# EAGLE schematic Nano CAN shield v0.1 (EAGLE 9.3.1)

## Sheet 1 of 2
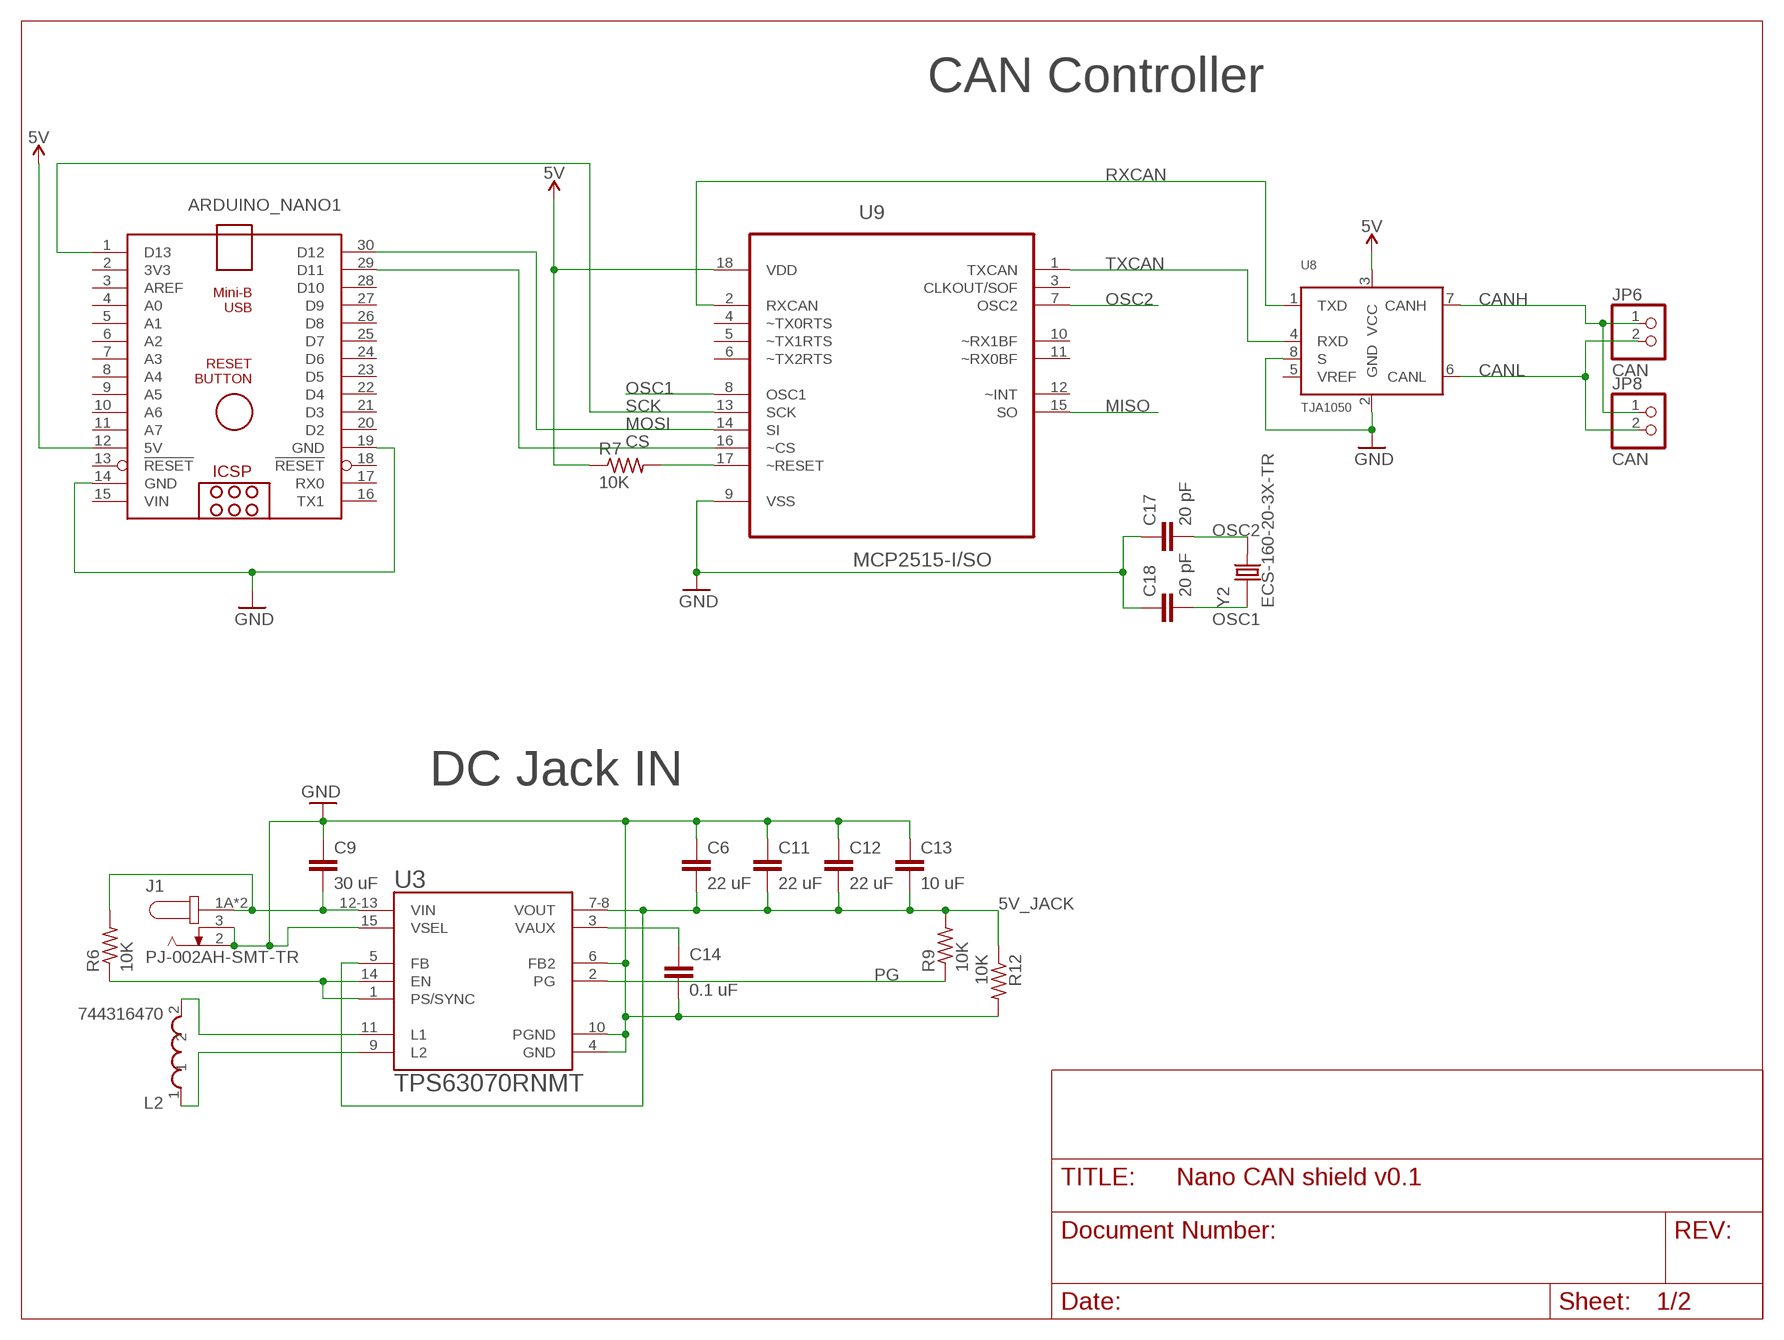
[diagram p0: schematic, sheet 1]

### Parts
ARDUINO_NANO1  ARDUINO_NANO  [ARDUINO_NANO]
C6  22 uF  C-EUC0603  [C0603]
C9  30 uF  C-EUC0603  [C0603]
C11  22 uF  C-EUC0603  [C0603]
C12  22 uF  C-EUC0603  [C0603]
C13  10 uF  C-EUC0603  [C0603]
C14  0.1 uF  C-EUC0603  [C0603]
C17  20 pF  C-EUC0603  [C0603]
C18  20 pF  C-EUC0603  [C0603]
J1  PJ-002AH-SMT-TR  [CUI_PJ-002AH-SMT-TR]
JP6  CAN  PINHD-1X2  [1X02]
JP8  CAN  PINHD-1X2  [1X02]
L2  744316470  [INDC2220X16]
R6  10K  R-US_R0603  [R0603]
R7  10K  R-US_R0603  [R0603]
R9  10K  R-US_R0603  [R0603]
R12  10K  R-US_R0603  [R0603]
U3  TPS63070RNMT  [QFN50P250X300X100-15N]
U8  TJA1050  [SOT96-1]
U9  MCP2515-I/SO  [SOIC127P1034X264-18N]
Y2  ECS-160-20-3X-TR  [XTAL_ECS-160-20-3X-TR]

### Nets
5V: ARDUINO_NANO1.12(5V) R7.1 U8.3(VCC) U9.18(VDD)
5V_JACK: C6.2 C11.2 C12.2 C13.2 R9.2 R12.1 U3.5(FB) U3.7-8(VOUT)
CANH: JP6.1 JP8.1 U8.7(CANH)
CANL: JP6.2 JP8.2 U8.6(CANL)
CS: ARDUINO_NANO1.29(D11) U9.16(~CS)
GND: ARDUINO_NANO1.14(GND) ARDUINO_NANO1.19(GND) C6.1 C9.1 C11.1 C12.1 C13.1 C14.2 C17.1 C18.1 J1.2 J1.3 R12.2 U3.4(GND) U3.6(FB2) U3.10(PGND) U3.15(VSEL) U8.2(GND) U8.8(S) U9.9(VSS)
MISO: U9.15(SO)
MOSI: ARDUINO_NANO1.30(D12) U9.14(SI)
N$7: C9.2 J1.1A J1.1B R6.2 U3.12-13(VIN)
N$13: L2.2 U3.11(L1)
N$14: L2.1 U3.9(L2)
N$15: C14.1 U3.3(VAUX)
N$20: R6.1 U3.1(PS/SYNC) U3.14(EN)
N$27: R7.2 U9.17(~RESET)
OSC1: C18.2 U9.8(OSC1) Y2.1
OSC2: C17.2 U9.7(OSC2) Y2.2
PG: R9.1 U3.2(PG)
RXCAN: U8.1(TXD) U9.2(RXCAN)
SCK: ARDUINO_NANO1.1(D13) U9.13(SCK)
TXCAN: U8.4(RXD) U9.1(TXCAN)
Unconnected: ARDUINO_NANO1.2(3V3) ARDUINO_NANO1.3(AREF) ARDUINO_NANO1.4(A0) ARDUINO_NANO1.5(A1) ARDUINO_NANO1.6(A2) ARDUINO_NANO1.7(A3) ARDUINO_NANO1.8(A4) ARDUINO_NANO1.9(A5) ARDUINO_NANO1.10(A6) ARDUINO_NANO1.11(A7) ARDUINO_NANO1.13(!RESET) ARDUINO_NANO1.16(TX1) ARDUINO_NANO1.17(RX0) ARDUINO_NANO1.18(!RESET) ARDUINO_NANO1.20(D2) ARDUINO_NANO1.21(D3) ARDUINO_NANO1.22(D4) ARDUINO_NANO1.23(D5) ARDUINO_NANO1.24(D6) ARDUINO_NANO1.25(D7) ARDUINO_NANO1.26(D8) ARDUINO_NANO1.27(D9) ARDUINO_NANO1.28(D10) U8.5(VREF) U9.3(CLKOUT/SOF) U9.4(~TX0RTS) U9.5(~TX1RTS) U9.6(~TX2RTS) U9.10(~RX1BF) U9.11(~RX0BF) U9.12(~INT)

### Notes on the sheet
- CAN Controller
- DC Jack IN

## Sheet 2 of 2
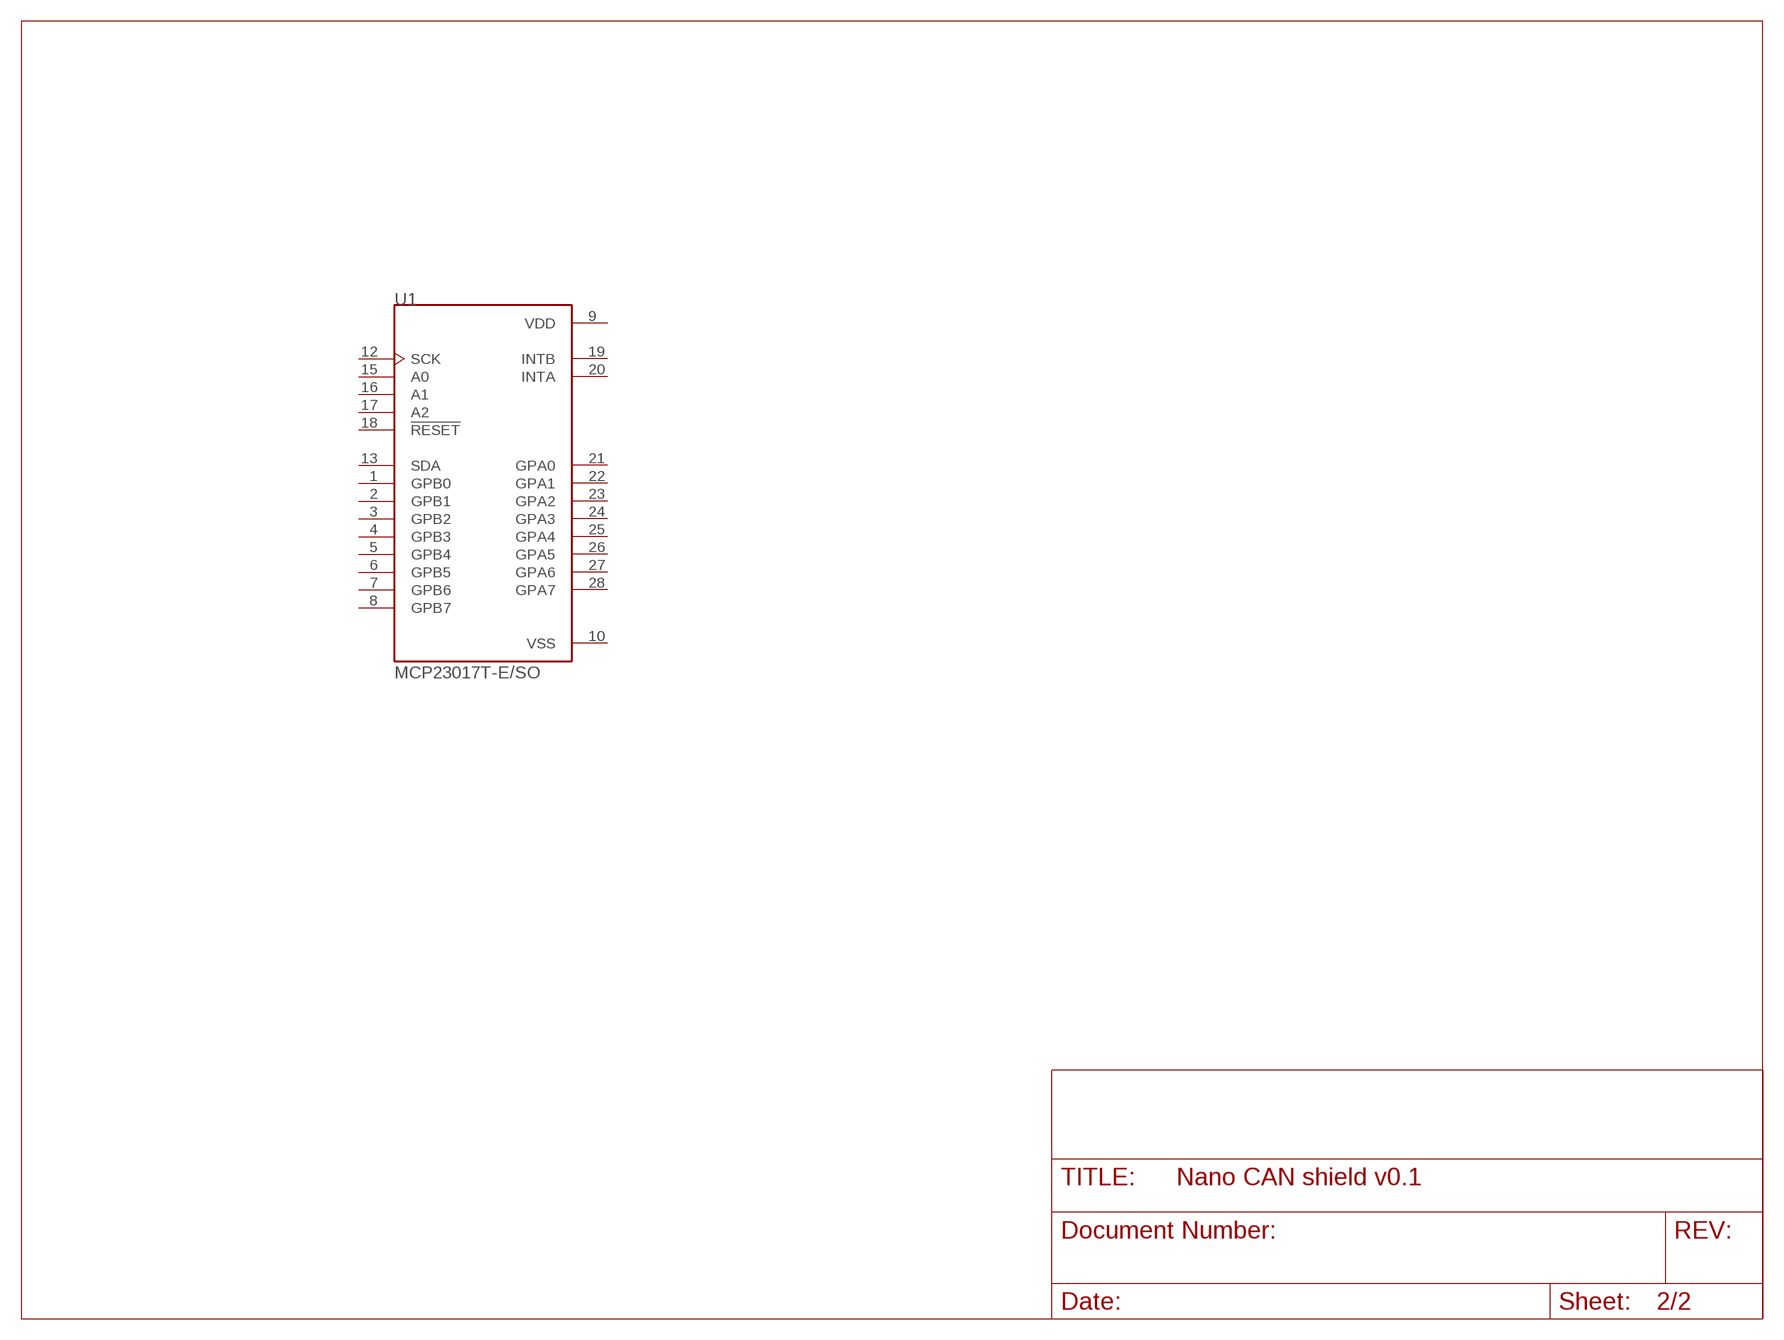
[diagram p1: schematic, sheet 2]

### Parts
U1  MCP23017T-E/SO  [SOIC127P1030X265-28N]
Unconnected: U1.1(GPB0) U1.2(GPB1) U1.3(GPB2) U1.4(GPB3) U1.5(GPB4) U1.6(GPB5) U1.7(GPB6) U1.8(GPB7) U1.12(SCK) U1.13(SDA) U1.15(A0) U1.16(A1) U1.17(A2) U1.18(!RESET) U1.19(INTB) U1.20(INTA) U1.21(GPA0) U1.22(GPA1) U1.23(GPA2) U1.24(GPA3) U1.25(GPA4) U1.26(GPA5) U1.27(GPA6) U1.28(GPA7)

## Power pins joined to a net without a drawn wire
VDD: U1.9(VDD)
VIN: ARDUINO_NANO1.15(VIN)
VSS: U1.10(VSS)

## Library data of the parts
ARDUINO_NANO1 = ArduinoNanoV30:ARDUINO_NANO: Arduino Nano V3.0 Overview: The Arduino Nano is a small, complete, and breadboard-friendly board based on the ATmega328 (Arduino Nano 3.x) or ATmega168 (Arduino Nano 2.x). It has more or less the same functionality of the Arduino Duemilanove, but in a different package. It lacks only a DC power jack, and works with a Mini-B USB cable instead of a standard one. The Nano was designed and is being produced by Gravitech. Specifications: Microcontroller Atmel ATmega168 or ATmega328 Operating Voltage (logic level) 5 V Input Voltage (recommended) 7-12 V Input Voltage (limits) 6-20 V Digital I/O Pins 14 (of which 6 provide PWM output) Analog Input Pins 8 DC Current per I/O Pin 40 mA Flash Memory 16 KB (ATmega168) or 32 KB (ATmega328) of which 2 KB used by bootloader SRAM 1 KB (ATmega168) or 2 KB (ATmega328) EEPROM 512 bytes (ATmega168) or 1 KB (ATmega328) Clock Speed 16 MHz Dimensions 0.73" x 1.70" Length 45 mm Width 18 mm Weigth 5 g Power: The Arduino Nano can be powered via the Mini-B USB connection, 6-20V unregulated external power supply (pin 30), or 5V regulated external power supply (pin 27). The power source is automatically selected to the highest voltage source. Memory: The ATmega168 has 16 KB of flash memory for storing code (of which 2 KB is used for the bootloader); the ATmega328 has 32 KB, (also with 2 KB used for the bootloader). The ATmega168 has 1 KB of SRAM and 512 bytes of EEPROM (which can be read and written with the EEPROM library); the ATmega328 has 2 KB of SRAM and 1 KB of EEPROM. Input and Output: Each of the 14 digital pins on the Nano can be used as an input or output, using pinMode(), digitalWrite(), and digitalRead() functions. They operate at 5 volts. Each pin can provide or receive a maximum of 40 mA and has an internal pull-up resistor (disconnected by default) of 20-50 kOhms. In addition, some pins have specialized functions. Visit Arduino - ArduinoBoardNano <https://www.arduino.cc/en/Main/ArduinoBoardNano>
C6 C9 C11-C14 C17 C18 = rcl:C-EU: CAPACITOR, European symbol; SPICEPREFIX: C
J1 = PJ-002AH-SMT-TR:PJ-002AH-SMT-TR: 2.0 mm Center Pin, 5.0 A, Right Angle, Surface Mount (SMT), Dc Power Jack Connector; CUI_PURCHASE_URL: https://www.cui.com/product/interconnect/dc-power-connectors/jacks/2.0-mm-center-pin/pj-002ah-smt-tr?utm_source=snapeda.com&utm_medium=referral&utm_campaign=snapedaBOM; DESCRIPTION: 24 VDC 5 A Surface Mount Unshielded 2 Conductors 3 Contacts Male Power Jack; DIGI-KEY_PART_NUMBER: CP-002AHPJCT-ND; DIGI-KEY_PURCHASE_URL: https://www.digikey.com/product-detail/en/cui-inc/PJ-002AH-SMT-TR/CP-002AHPJCT-ND/669692?utm_source=snapeda&utm_medium=aggregator&utm_campaign=symbol; MF: CUI Inc.; MP: PJ-002AH-SMT-TR; PACKAGE: None
JP6 JP8 = pinhead:PINHD-1X2: PIN HEADER
L2 = 744316470:744316470: Surface Mount Power Inductor, WE-HCI Series, 4.7 H, 20%, Shielded, 0.0245 ohm, 4.6 A; AVAILABILITY: Unavailable; DESCRIPTION: Surface Mount Power Inductor, WE-HCI Series, 4.7 H, 20%, Shielded, 0.0245 ohm, 4.6 A; MF: Wurth Electronics; MP: 744316470; PACKAGE: SMD-2 Würth Elektronik; PRICE: None
R6 R7 R9 R12 = rcl:R-US_: RESISTOR, American symbol; SPICEPREFIX: R
U1 = MCP23017T-E_SO:MCP23017T-E/SO: 16-bit Input/Output Expander, I2C interface, Pb-free28 SOIC .300in T/R; DESCRIPTION: 16-bit Input/Output Expander, I2C interface, Pb-free28 SOIC .300in T/R; DIGI-KEY_PART_NUMBER: MCP23017T-E/SOCT-ND; DIGI-KEY_PURCHASE_URL: https://www.digikey.com/product-detail/en/microchip-technology/MCP23017T-E-SO/MCP23017T-E-SOCT-ND/5358289?utm_source=snapeda&utm_medium=aggregator&utm_campaign=symbol; MF: Microchip; MP: MCP23017T-E/SO; PACKAGE: SOIC-28 Microchip
U3 = TPS63070RNMT:TPS63070RNMT: Wide Input Voltage (2V-16V) Buck-Boost Converter 15-VQFN-HR; AVAILABILITY: Unavailable; DESCRIPTION: Conv DC-DC 2V to 16V Step Down/Step Up Single-Out 2.5V to 9V 2A 15-Pin VQFN-HR T/R; MF: Texas Instruments; MP: TPS63070RNMT; PACKAGE: VQFN-15 Texas Instruments; PRICE: None
U8 = TJA1050:TJA1050: High speed CAN transceiver The TJA1050 is the interface between the Controller Area Network (CAN) protocol controller and the physical bus. The device provides differential transmit capability to the bus and differential receive capability to the CAN controller. The TJA1050 is the third Philips high-speed CAN transceiver after the PCA82C250 and the PCA82C251. The most important differences are: Much lower electromagnetic emission due to optimal matching of the output signals CANH and CANL Improved behaviour in case of an unpowered node No standby mode. This makes the TJA1050 eminently suitable for use in nodes that are in a power-down situation in partially powered networks. AAL Eindhoven MK; DIGI-KEY_PART_NUMBER: 568-10292-1-ND; DIGI-KEY_PURCHASE_URL: https://www.digikey.com/product-detail/en/nxp-usa-inc/TJA1050T-CM,118/568-10292-1-ND/4162437?utm_source=snapeda&utm_medium=aggregator&utm_campaign=symbol; MF: NXP USA; MP: TJA1050; PACKAGE: SOIC-8 NXP USA
U9 = MCP2515-I_SO:MCP2515-I/SO: CAN Controller; DESCRIPTION: MCP2515 Series 5.5 V 1 Mb/s Stand Alone SPI Interface CAN Controller- SOIC-18; DIGI-KEY_PART_NUMBER: MCP2515-I/SO-ND; DIGI-KEY_PURCHASE_URL: https://www.digikey.com/product-detail/en/microchip-technology/MCP2515-I-SO/MCP2515-I-SO-ND/593001?utm_source=snapeda&utm_medium=aggregator&utm_campaign=symbol; MF: Microchip; MP: MCP2515-I/SO; PACKAGE: SOIC-18 Microchip
Y2 = ECS-160-20-3X-TR:ECS-160-20-3X-TR: SMD QUARTZ CRYSTAL; AVAILABILITY: Unavailable; DESCRIPTION: CSM-3X Series 16 MHz ±30 ppm 20 pF -10 to +70 °C Surface Mount Quartz Crystal; MF: ECS Inc.; MP: ECS-160-20-3X-TR; PACKAGE: HC49/US ECS International; PRICE: None